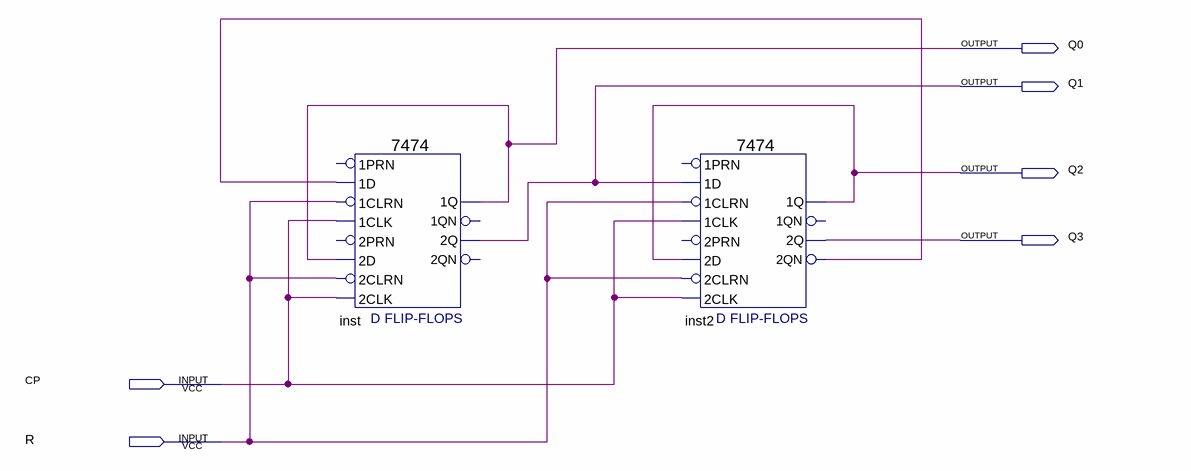
[diagram p0: schematic sheet]
// Quartus schematic ex6-2.bdf as structural Verilog: 2 symbols, 6 pins
module \ex6-2  (
  input  CP,
  input  R,
  output Q0,
  output Q1,
  output Q2,
  output Q3
);

  wire inst2_2qn;

  \7474  inst (
    .\2D (Q0), .\1CLK (CP), .\1D (inst2_2qn), .\2CLK (CP), .\2CLRN (R), .\1CLRN (R), .\2Q (Q1), .\1Q (Q0));  // open: 2PRN, 1PRN, 1QN, 2QN
  \7474  inst2 (
    .\2D (Q2), .\1CLK (CP), .\1D (Q1), .\2CLK (CP), .\2CLRN (R), .\1CLRN (R), .\2Q (Q3), .\2QN (inst2_2qn),
    .\1Q (Q2));  // open: 2PRN, 1PRN, 1QN
endmodule
